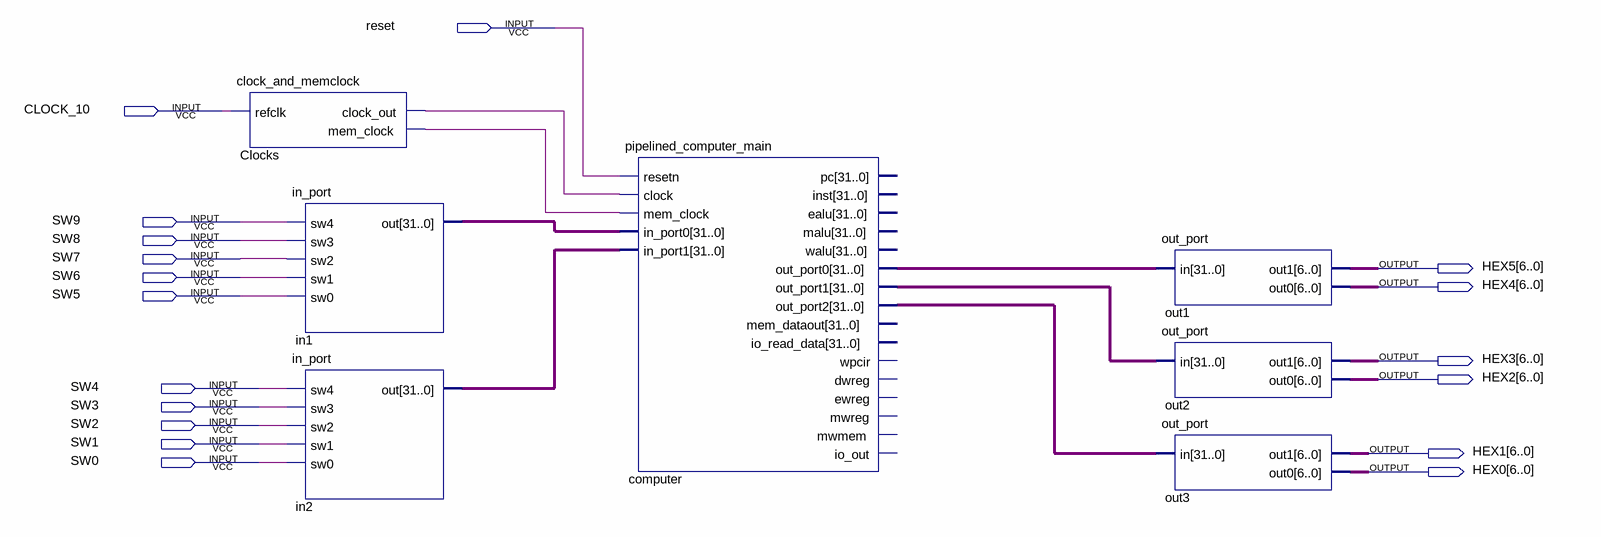
[diagram p0: schematic sheet]
// Quartus schematic pipelined_computer.bdf as structural Verilog: 7 symbols, 18 pins
module pipelined_computer (
  input  reset,
  input  CLOCK_10,
  input  SW9,
  input  SW8,
  input  SW7,
  input  SW6,
  input  SW5,
  input  SW4,
  input  SW3,
  input  SW2,
  input  SW1,
  input  SW0,
  output [6:0] HEX5,
  output [6:0] HEX4,
  output [6:0] HEX3,
  output [6:0] HEX2,
  output [6:0] HEX1,
  output [6:0] HEX0
);

  wire Clocks_clock_out, Clocks_mem_clock;
  wire [31:0] computer_out_port0, computer_out_port1, computer_out_port2, in1_out, in2_out;

  clock_and_memclock Clocks (.refclk(CLOCK_10), .clock_out(Clocks_clock_out), .mem_clock(Clocks_mem_clock));
  in_port in1 (.sw4(SW9), .sw3(SW8), .sw2(SW7), .sw1(SW6), .sw0(SW5), .out(in1_out));
  in_port in2 (.sw4(SW4), .sw3(SW3), .sw2(SW2), .sw1(SW1), .sw0(SW0), .out(in2_out));
  pipelined_computer_main computer (
    .resetn(reset), .clock(Clocks_clock_out), .mem_clock(Clocks_mem_clock), .in_port0(in1_out),
    .in_port1(in2_out), .out_port0(computer_out_port0), .out_port1(computer_out_port1),
    .out_port2(computer_out_port2));  // open: pc, inst, ealu, malu, walu, mem_dataout, io_read_data, wpcir, dwreg, ewreg, mwreg, mwmem, io_out
  out_port out1 (.in(computer_out_port0), .out1(HEX5), .out0(HEX4));
  out_port out2 (.in(computer_out_port1), .out1(HEX3), .out0(HEX2));
  out_port out3 (.in(computer_out_port2), .out1(HEX1), .out0(HEX0));
endmodule
